# Altium schematic sheet inversor_rev3.SchDoc
size A3
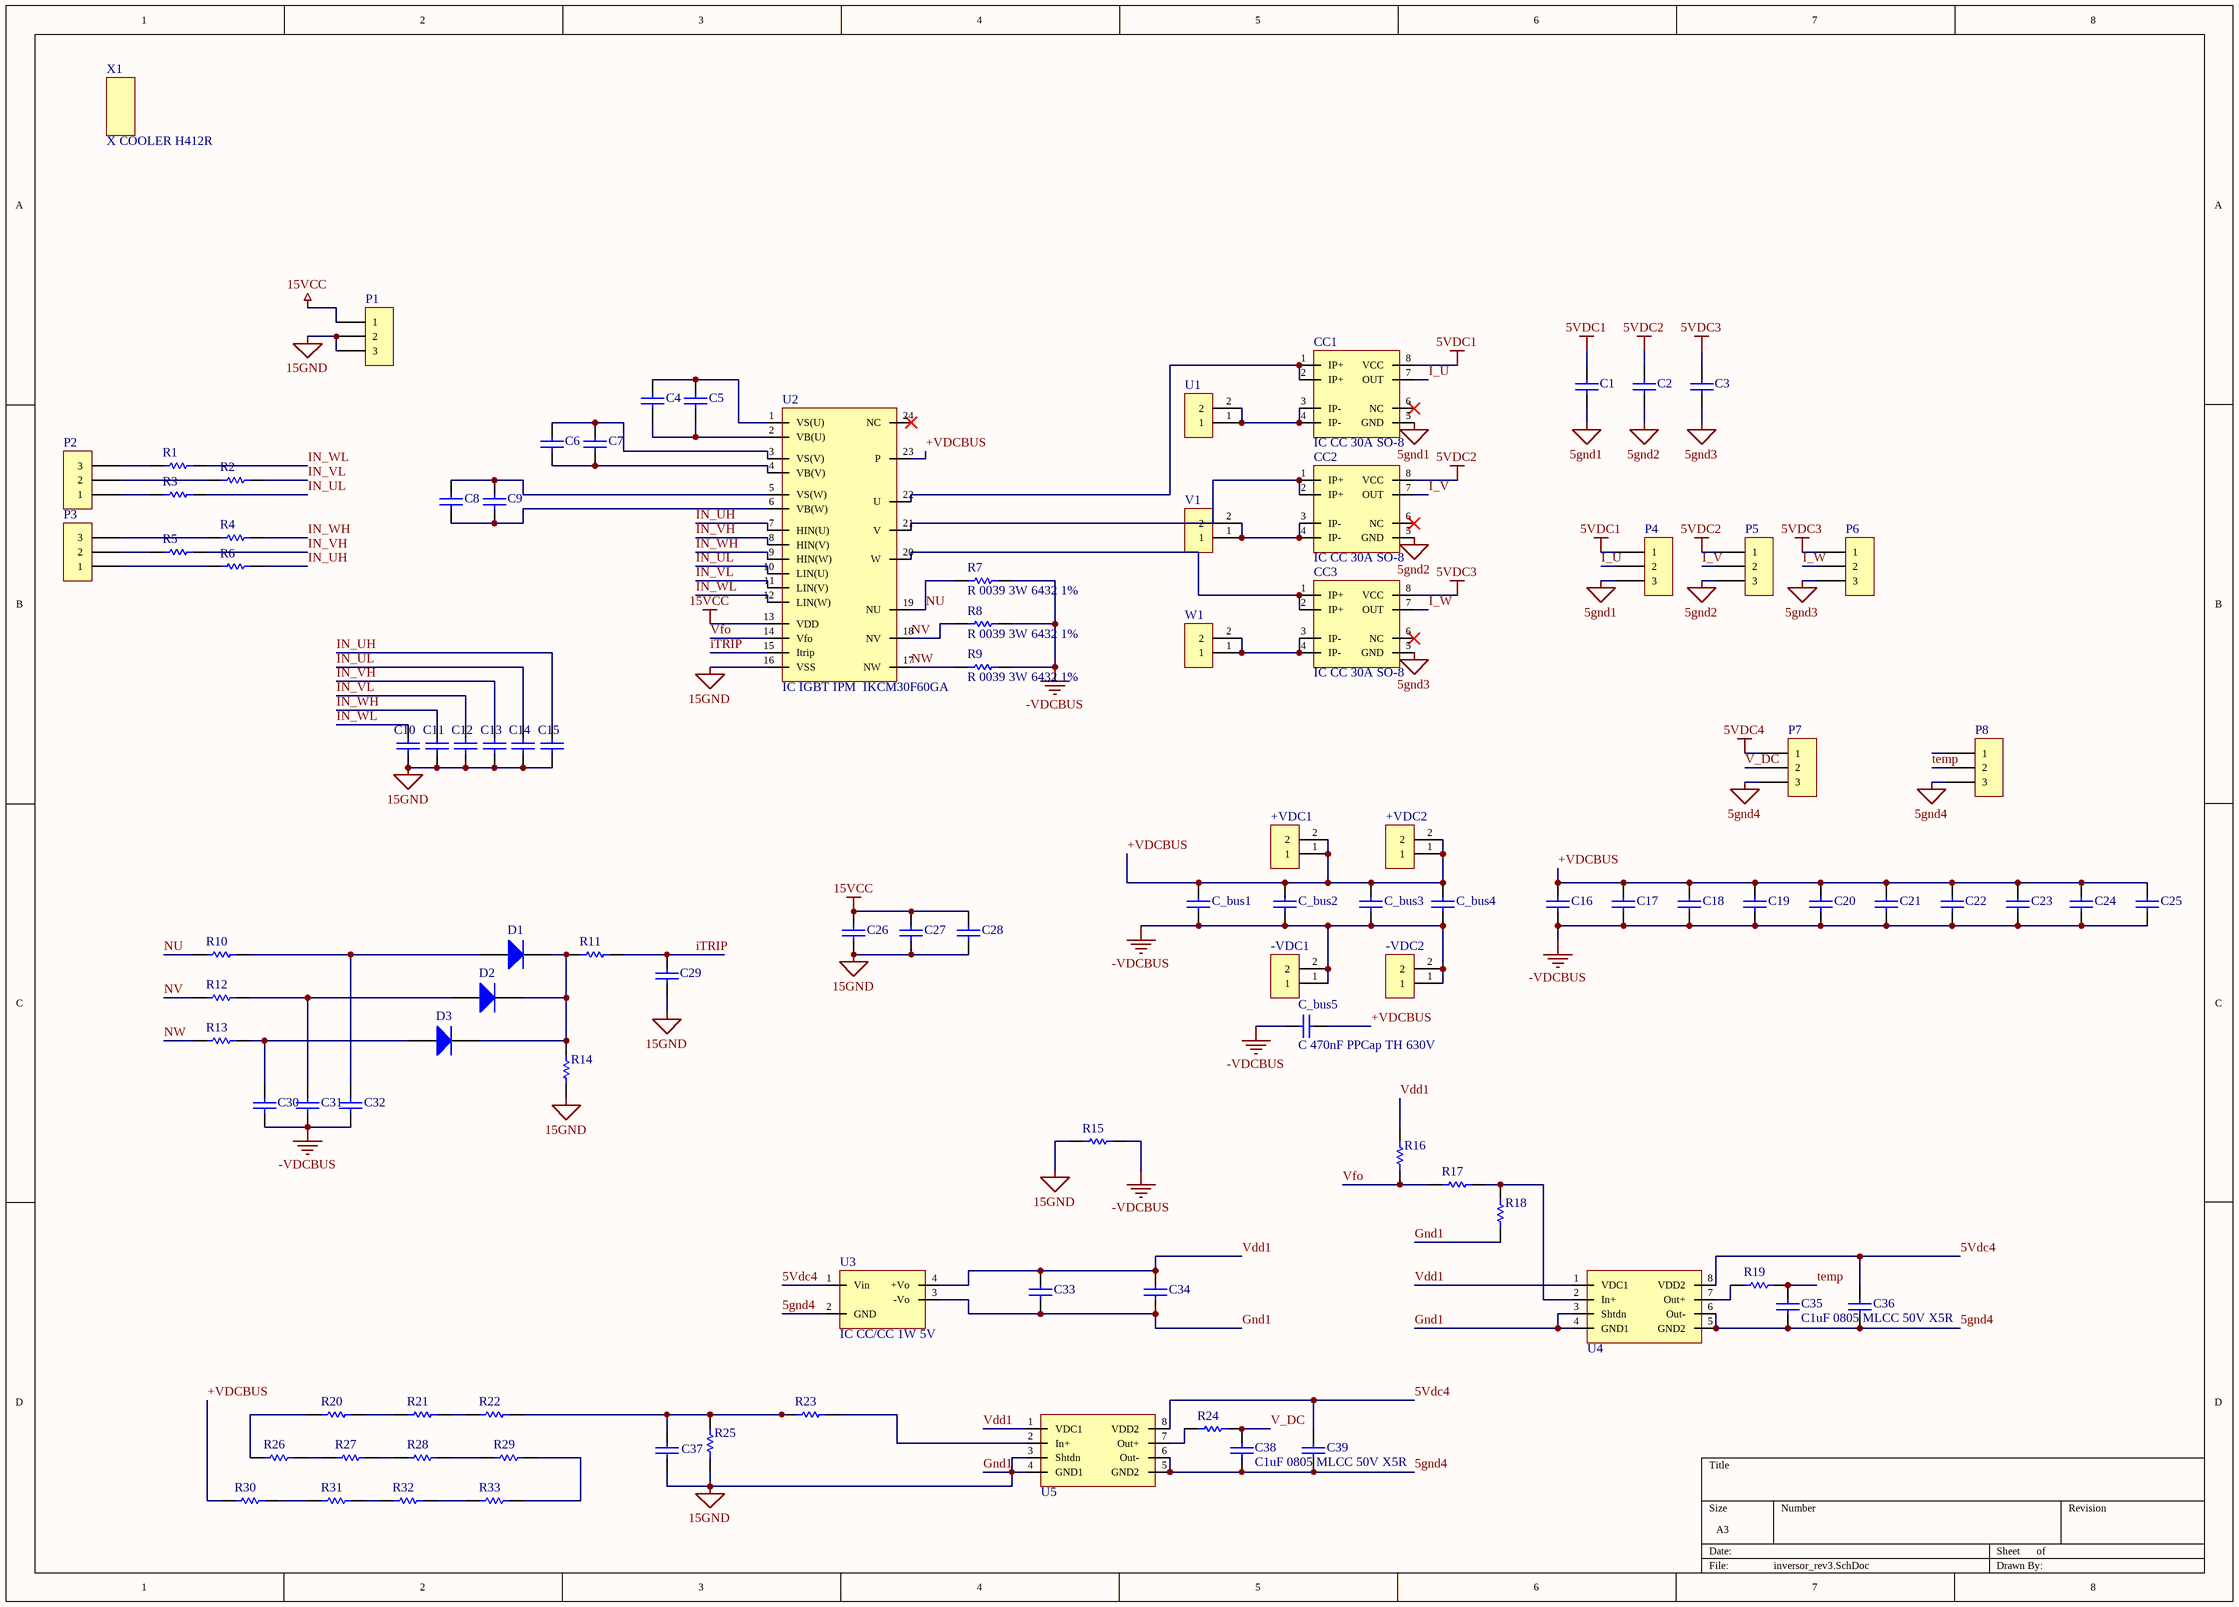
[diagram p0: inversor_rev3.SchDoc]

## Parts
+VDC1  P 2p 5mm  [connector1x2_parafuso]  (value not drawn)
+VDC2  P 2p 5mm  [connector1x2_parafuso]  (value not drawn)
-VDC1  P 2p 5mm  [connector1x2_parafuso]  (value not drawn)
-VDC2  P 2p 5mm  [connector1x2_parafuso]  (value not drawn)
C1  C 10uF 0805 MLCC 25V X5R  [CAPC_0805]  (value not drawn)
C2  C 10uF 0805 MLCC 25V X5R  [CAPC_0805]  (value not drawn)
C3  C 10uF 0805 MLCC 25V X5R  [CAPC_0805]  (value not drawn)
C4  C 10uF 2917 TANT 50V  [CAPC_2917]  (value not drawn)
C5  C 10uF 2917 TANT 50V  [CAPC_2917]  (value not drawn)
C6  C 10uF 2917 TANT 50V  [CAPC_2917]  (value not drawn)
C7  C 10uF 2917 TANT 50V  [CAPC_2917]  (value not drawn)
C8  C 10uF 2917 TANT 50V  [CAPC_2917]  (value not drawn)
C9  C 10uF 2917 TANT 50V  [CAPC_2917]  (value not drawn)
C10  C 1nF 0805 MLCC 50V X7R  [CAPC_0805]  (value not drawn)
C11  C 1nF 0805 MLCC 50V X7R  [CAPC_0805]  (value not drawn)
C12  C 1nF 0805 MLCC 50V X7R  [CAPC_0805]  (value not drawn)
C13  C 1nF 0805 MLCC 50V X7R  [CAPC_0805]  (value not drawn)
C14  C 1nF 0805 MLCC 50V X7R  [CAPC_0805]  (value not drawn)
C15  C 1nF 0805 MLCC 50V X7R  [CAPC_0805]  (value not drawn)
C16  C 100nF MLCC 1812 X7R 1kV  [CAPC_1812]  (value not drawn)
C17  C 100nF MLCC 1812 X7R 1kV  [CAPC_1812]  (value not drawn)
C18  C 100nF MLCC 1812 X7R 1kV  [CAPC_1812]  (value not drawn)
C19  C 100nF MLCC 1812 X7R 1kV  [CAPC_1812]  (value not drawn)
C20  C 100nF MLCC 1812 X7R 1kV  [CAPC_1812]  (value not drawn)
C21  C 100nF MLCC 1812 X7R 1kV  [CAPC_1812]  (value not drawn)
C22  C 100nF MLCC 1812 X7R 1kV  [CAPC_1812]  (value not drawn)
C23  C 100nF MLCC 1812 X7R 1kV  [CAPC_1812]  (value not drawn)
C24  C 100nF MLCC 1812 X7R 1kV  [CAPC_1812]  (value not drawn)
C25  C 100nF MLCC 1812 X7R 1kV  [CAPC_1812]  (value not drawn)
C26  C 10uF 2917 TANT 50V  [CAPC_2917]  (value not drawn)
C27  C 10uF 2917 TANT 50V  [CAPC_2917]  (value not drawn)
C28  C 10uF 0805 MLCC 25V X5R  [CAPC_0805]  (value not drawn)
C29  C 10nF 0805 MLCC 50V X7R  [CAPC_0805]  (value not drawn)
C30  C 10nF 0805 MLCC 50V X7R  [CAPC_0805]  (value not drawn)
C31  C 10nF 0805 MLCC 50V X7R  [CAPC_0805]  (value not drawn)
C32  C 10nF 0805 MLCC 50V X7R  [CAPC_0805]  (value not drawn)
C33  C 10uF 0805 MLCC 25V X5R  [CAPC_0805]  (value not drawn)
C34  C 10uF 2917 TANT 50V  [CAPC_2917]  (value not drawn)
C35  C1uF 0805 MLCC 50V X5R  [CAPC_0805]
C36  C 10uF 0805 MLCC 25V X5R  [CAPC_0805]  (value not drawn)
C37  C1uF 0805 MLCC 50V X5R  [CAPC_0805]  (value not drawn)
C38  C1uF 0805 MLCC 50V X5R  [CAPC_0805]
C39  C 10uF 0805 MLCC 25V X5R  [CAPC_0805]  (value not drawn)
C_bus1  C 470uF EleCap TH 450V  [Capacitor_DCBUS]  (value not drawn)
C_bus2  C 470uF EleCap TH 450V  [Capacitor_DCBUS]  (value not drawn)
C_bus3  C 470uF EleCap TH 450V  [Capacitor_DCBUS]  (value not drawn)
C_bus4  C 470uF EleCap TH 450V  [Capacitor_DCBUS]  (value not drawn)
C_bus5  C 470nF PPCap TH 630V  [Snubber_cap_0.47uF]
CC1  IC CC 30A SO-8  [CC6303_SOP8]
CC2  IC CC 30A SO-8  [CC6303_SOP8]
CC3  IC CC 30A SO-8  [CC6303_SOP8]
D1  IC DIO generic  [Diode_th]  (value not drawn)
D2  IC DIO generic  [Diode_th]  (value not drawn)
D3  IC DIO generic  [Diode_th]  (value not drawn)
P1  P 8p 2.54 SR DW 3P  [MOLEX_3p_105431_1103]  (value not drawn)
P2  P 8p 2.54 SR DW 3P  [MOLEX_3p_105431_1103]  (value not drawn)
P3  P 8p 2.54 SR DW 3P  [MOLEX_3p_105431_1103]  (value not drawn)
P4  P 8p 2.54 SR DW 3P  [MOLEX_3p_105431_1103]  (value not drawn)
P5  P 8p 2.54 SR DW 3P  [MOLEX_3p_105431_1103]  (value not drawn)
P6  P 8p 2.54 SR DW 3P  [MOLEX_3p_105431_1103]  (value not drawn)
P7  P 8p 2.54 SR DW 3P  [MOLEX_3p_105431_1103]  (value not drawn)
P8  P 8p 2.54 SR DW 3P  [MOLEX_3p_105431_1103]  (value not drawn)
R1  R 100 1/8W 0805 1%  [RESC_0805]  (value not drawn)
R2  R 100 1/8W 0805 1%  [RESC_0805]  (value not drawn)
R3  R 100 1/8W 0805 1%  [RESC_0805]  (value not drawn)
R4  R 100 1/8W 0805 1%  [RESC_0805]  (value not drawn)
R5  R 100 1/8W 0805 1%  [RESC_0805]  (value not drawn)
R6  R 100 1/8W 0805 1%  [RESC_0805]  (value not drawn)
R7  R 0039 3W 6432 1%  [RESC6432X09M]
R8  R 0039 3W 6432 1%  [RESC6432X09M]
R9  R 0039 3W 6432 1%  [RESC6432X09M]
R10  R 100 1/8W 0805 1%  [RESC_0805]  (value not drawn)
R11  R 1k8 1/8W 0805 1%  [RESC_0805]  (value not drawn)
R12  R 100 1/8W 0805 1%  [RESC_0805]  (value not drawn)
R13  R 100 1/8W 0805 1%  [RESC_0805]  (value not drawn)
R14  R 3K 1/8W 0805 1%  [RESC_0805]  (value not drawn)
R15  R 0 1/8W 0805  [RESC_0805]  (value not drawn)
R16  R 3k6 1/8W 0805 1%  [RESC_0805]  (value not drawn)
R17  R 49k9 1/8W 0805 1%  [RESC_0805]  (value not drawn)
R18  R 49k9 1/8W 0805 1%  [RESC_0805]  (value not drawn)
R19  R 330 1/8 0805 1%  [RESC_0805]  (value not drawn)
R20  R 30k 1/8W 0805 1%  [RESC_0805]  (value not drawn)
R21  R 30k 1/8W 0805 1%  [RESC_0805]  (value not drawn)
R22  R 30k 1/8W 0805 1%  [RESC_0805]  (value not drawn)
R23  R 30k 1/8W 0805 1%  [RESC_0805]  (value not drawn)
R24  R 330 1/8 0805 1%  [RESC_0805]  (value not drawn)
R25  R 150R 1/8W 0805 1%  [RESC_0805]  (value not drawn)
R26  R 30k 1/8W 0805 1%  [RESC_0805]  (value not drawn)
R27  R 30k 1/8W 0805 1%  [RESC_0805]  (value not drawn)
R28  R 30k 1/8W 0805 1%  [RESC_0805]  (value not drawn)
R29  R 30k 1/8W 0805 1%  [RESC_0805]  (value not drawn)
R30  R 30k 1/8W 0805 1%  [RESC_0805]  (value not drawn)
R31  R 30k 1/8W 0805 1%  [RESC_0805]  (value not drawn)
R32  R 30k 1/8W 0805 1%  [RESC_0805]  (value not drawn)
R33  R 30k 1/8W 0805 1%  [RESC_0805]  (value not drawn)
U1  P 2p 5mm  [connector1x2_parafuso]  (value not drawn)
U2  IC IGBT IPM  IKCM30F60GA  [ikcm30f60ga]
U3  IC CC/CC 1W 5V  [DC/DC_ISO]
U4  IC AmpIso UNI AMC1311  [AMC1311 - SOIC8]  (value not drawn)
U5  IC AmpIso UNI AMC1311  [AMC1311 - SOIC8]  (value not drawn)
V1  P 2p 5mm  [connector1x2_parafuso]  (value not drawn)
W1  P 2p 5mm  [connector1x2_parafuso]  (value not drawn)
X1  X COOLER H412R  [COOLER]

## Nets
5gnd1: C1.1 CC1.5(GND) P4.3
5gnd2: C2.1 CC2.5(GND) P5.3
5gnd3: C3.1 CC3.5(GND) P6.3
5gnd4: C35.1 C36.1 C38.1 C39.1 P7.3 P8.3 U3.2(GND) U4.5(GND2) U4.6(Out-) U5.5(GND2) U5.6(Out-)
5VDC1: C1.2 CC1.8(VCC) P4.1
5VDC2: C2.2 CC2.8(VCC) P5.1
5VDC3: C3.2 CC3.8(VCC) P6.1
5Vdc4: C36.2 C39.2 P7.1 U3.1(Vin) U4.8(VDD2) U5.8(VDD2)
15VCC: C26.2 C27.2 C28.2 P1.1 U2.13(VDD)
-VDCBUS: -VDC1.1 -VDC1.2 -VDC2.1 -VDC2.2 C16.1 C17.1 C18.1 C19.1 C20.1 C21.1 C22.1 C23.1 C24.1 C25.1 C30.1 C31.1 C32.1 C_bus1.1 C_bus2.1 C_bus3.1 C_bus4.1 C_bus5.1 R7.2 R8.2 R9.2 R15.2
Gnd1: C10.1 C11.1 C12.1 C13.1 C14.1 C15.1 C26.1 C27.1 C28.1 C29.1 C33.1 C34.1 C37.1 P1.2 P1.3 R14.1 R15.1 R18.1 R25.1 U2.16(VSS) U3.3(-Vo) U4.3(Shtdn) U4.4(GND1) U5.3(Shtdn) U5.4(GND1)  [also labelled 15GND]
+VDCBUS: +VDC1.1 +VDC1.2 +VDC2.1 +VDC2.2 C16.2 C17.2 C18.2 C19.2 C20.2 C21.2 C22.2 C23.2 C24.2 C25.2 C_bus1.2 C_bus2.2 C_bus3.2 C_bus4.2 C_bus5.2 R30.1 U2.23(P)
I_U: CC1.7(OUT) P4.2
I_V: CC2.7(OUT) P5.2
I_W: CC3.7(OUT) P6.2
IN_UH: C15.2 R6.1 U2.7(HIN(U))
IN_UL: C14.2 R3.1 U2.10(LIN(U))
IN_VH: C13.2 R5.1 U2.8(HIN(V))
IN_VL: C12.2 R2.1 U2.11(LIN(V))
IN_WH: C11.2 R4.1 U2.9(HIN(W))
IN_WL: C10.2 R1.1 U2.12(LIN(W))
iTRIP: C29.2 R11.2 U2.15(Itrip)
NU: R7.1 R10.1 U2.19(NU)
NV: R8.1 R12.1 U2.18(NV)
NW: R9.1 R13.1 U2.17(NW)
temp: C35.2 P8.2 R19.2
V_DC: C38.2 P7.2 R24.2
Vdd1: C33.2 C34.2 R16.1 U3.4(+Vo) U4.1(VDC1) U5.1(VDC1)
Vfo: R16.2 R17.1 U2.14(Vfo)
NetC4_1: C4.1 C5.1 U2.2(VB(U))
NetC4_2: C4.2 C5.2 U2.1(VS(U))
NetC6_1: C6.1 C7.1 U2.4(VB(V))
NetC6_2: C6.2 C7.2 U2.3(VS(V))
NetC8_1: C8.1 C9.1 U2.6(VB(W))
NetC8_2: C8.2 C9.2 U2.5(VS(W))
NetC30_2: C30.2 D3.1(A) R13.2
NetC31_2: C31.2 D2.1(A) R12.2
NetC32_2: C32.2 D1.1(A) R10.2
NetC37_2: C37.2 R22.2 R23.1 R25.2
NetCC1_1: CC1.1(IP+) CC1.2(IP+) U2.22(U)
NetCC1_3: CC1.3(IP-) CC1.4(IP-) U1.1 U1.2
NetCC2_1: CC2.1(IP+) CC2.2(IP+) U2.21(V)
NetCC2_3: CC2.3(IP-) CC2.4(IP-) V1.1 V1.2
NetCC3_1: CC3.1(IP+) CC3.2(IP+) U2.20(W)
NetCC3_3: CC3.3(IP-) CC3.4(IP-) W1.1 W1.2
NetD1_2: D1.2(K) D2.2(K) D3.2(K) R11.1 R14.2
NetP2_1: P2.1 R3.2
NetP2_2: P2.2 R2.2
NetP2_3: P2.3 R1.2
NetP3_1: P3.1 R6.2
NetP3_2: P3.2 R5.2
NetP3_3: P3.3 R4.2
NetR17_2: R17.2 R18.2 U4.2(In+)
NetR19_1: R19.1 U4.7(Out+)
NetR20_1: R20.1 R26.1
NetR20_2: R20.2 R21.1
NetR21_2: R21.2 R22.1
NetR23_2: R23.2 U5.2(In+)
NetR24_1: R24.1 U5.7(Out+)
NetR26_2: R26.2 R27.1
NetR27_2: R27.2 R28.1
NetR28_2: R28.2 R29.1
NetR29_2: R29.2 R33.2
NetR30_2: R30.2 R31.1
NetR31_2: R31.2 R32.1
NetR32_2: R32.2 R33.1

Not connected (* = marked no-connect by the designer): CC1 6(NC)*; CC2 6(NC)*; CC3 6(NC)*; P8 1; U2 24(NC)*

## Library data of the parts
+VDC1 +VDC2 -VDC1 -VDC2 U1 V1 W1 = gen_purpose_conn_1x2: Bloques de terminales de PCB de perfil estándar RS de 5,0 mm; RS VPN: 896-6696; Price: 0,24
C1-C3 C28 C33 C36 C39 = Capacitor SMD: Capacitores de cerâmica multicamada MLCC - SMD/SMT 10uF 25V X5R +/-10% 0805 Gen Purp; Mouser VPN: 963-TMK212BBJ106KG-T; Price: 0,162
C4-C9 C26 C27 C34 = tantalum_CAP: Condensadores de tântalo - revestimento sólido de SMD 50V 10uF 10% ESR=0.8Ohms; Mouser VPN: 80-T491D106K050AT; Price: 1,58
C10-C15 = Capacitor SMD: Capacitores de cerâmica multicamada MLCC - SMD/SMT WCAP-CSGP 1000pF 0805 10% 50V MLCC; Mouser VPN: 710-885012207086; Price: 0,08
C16-C25 = CAPACITOR_dcbus: Capacitores de cerâmica multicamada MLCC - SMD/SMT 1000V 0.1uF X7R 1812 10% AEC-Q200; Mouser VPN: 80-C1812C104KDRAUTO; Price: 0,747
C29-C32 = Capacitor SMD: Capacitores de cerâmica multicamada MLCC - SMD/SMT 10nF 50V X7R 10%; Mouser VPN: 603-CC805KRX7R9BB103; Price: 0,099
C35 C37 C38 = Capacitor SMD: Capacitores de cerâmica multicamada MLCC - SMD/SMT 0805 50V 1uF 20% X5R; Mouser VPN: 963-UMK212BJ105MG-T; Price: 0,153
C_bus1-C_bus4 = CAPACITOR_dcbus: Capacitores eletrolíticos de alumínio - terminal de pressão 450V 470uF 20% Tol.; Mouser VPN: 661-ESMR451N471MR40S; Price: 6,28
C_bus5 = CAPACITOR_dcbus: B32653A6474K000 -  DC Film Capacitor, 0.47 µF, 630 V, Metallized PP, ± 10%, B32653 Series; Farnell VPN: 9751343; Price: 2,18
CC1-CC3 = Current_Sensor_cc6303: Sensores de Corrente de Montagem de Painel Hall Effect IC LF 30A 66 mV/A; Mouser VPN: 630-ACHS-7123-000E; Price: 3,47
D1-D3 = Diode: Diodos - Fins gerais, energia, comutação Hi Conductance Fast; Mouser VPN: 512-1N4148TR; Price: 0,09
P1-P8 = Header 3: Distribuidores e Alojamento de Fios CGrid Hrd SRDW THo le 8ckt; Mouser VPN: 538-87937-0800; Mouser VPN: 801-87-008-10-001101; Price: 0,621
R1-R6 R10 R12 R13 = Resistor: Resistores de Filme Espesso - SMD 1/8Watt 100ohms 1% Commercial Use; Mouser VPN: 71-CRCW0805100RFKEAC; Price: 0,09
R7-R9 = Resistor: MCLRP12FTWRR039 -  SMD Current Sense Resistor, 0.039 ohm, LRP Series, 2512 [6432 Metric], 3 W, ± 1%, Metal Strip; Farnell VPN: 2828259; Price: 0,271
R11 = Resistor: Resistores de Filme Espesso - SMD ResA-AS 0805 1k8 1% 125mW TC100; Mouser VPN: 652-CR0805AFX1801EAS; Price: 0,09
R14 = Resistor: Resistores de Filme Espesso - SMD 1/8watt 3Kohms 1% 100ppm; Mouser VPN: 71-CRCW0805-3K-E3; Price: 0,09
R15 = Resistor: Resistores de Filme Espesso - SMD 1/8Watt 0ohms Commercial Use; Mouser VPN: 71-CRCW08050000Z0EAC; Price: 0,09
R16 = Resistor: Resistores de Filme Espesso - SMD 1/8watt 3.6Kohms 1%; Mouser VPN: 71-CRCW08053K60FKEA; Price: 0,09
R17 R18 = Resistor: Resistores de Filme Espesso - SMD 1/8Watt 49.9Kohms 1% Commercial Use; Mouser VPN: 71-CRCW080549K9FKEAC; Price: 0,09
R19 R24 = Resistor: Resistores de Filme Espesso - SMD 1/8Watt 330ohms 1% Commercial Use; Mouser VPN: 71-CRCW0805330RFKEAC; Price: 0,09
R20-R23 R26-R33 = Resistor: Resistores de Filme Espesso - SMD 0805 30Kohms 1% AEC-Q200; Mouser VPN: 667-ERJ-6ENF3002V; Price: 0,09
R25 = Resistor: Resistores de Filme Espesso - SMD 1/8watt 150ohms 1% 100ppm; Mouser VPN: 71-CRCW0805-150-E3; Price: 0,09
U2 = IKCM30F60GA: Controladores e drivers de Motor/Movimento/Ignição IFPS MODULES; Mouser VPN: 726-IKCM30F60GDXKMA1; Price: 16,25
U3 = DC/DC_ISO: Conversores CC/CC com isolação 1W 5Vin 5Vout 200mA SIP7; Mouser VPN: 919-RFB-0505S; Price: 1,4
U4 U5 = AMC1311: Amplificadores de isolamento A 595-AMC1311DWV; Mouser VPN: 595-AMC1311DWVR; Price: 5,55
X1 = cooler: Cooler CPU Cooler Master Hyper H412R; PCDIGA VPN: Cooler CPU Cooler Master Hyper H412R; Price: 22,90